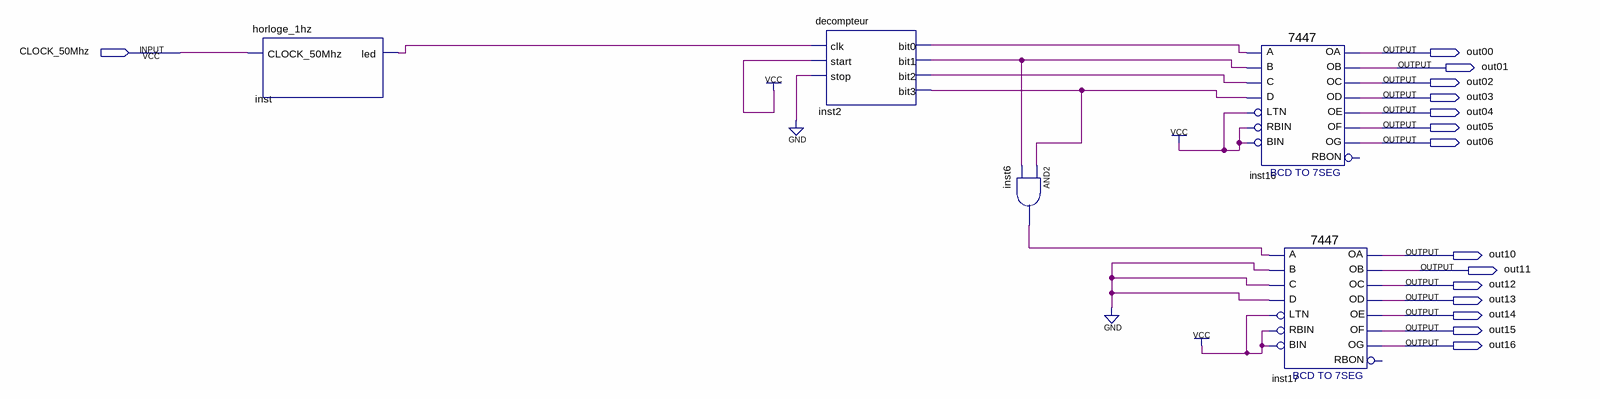
[diagram p0: schematic sheet]
// Quartus schematic compteur_9.bdf as structural Verilog: 5 symbols, 15 pins
module compteur_9 (
  input  CLOCK_50Mhz,
  output out00,
  output out01,
  output out02,
  output out03,
  output out04,
  output out05,
  output out06,
  output out10,
  output out11,
  output out12,
  output out13,
  output out14,
  output out15,
  output out16
);

  wire inst2_bit0, inst2_bit1, inst2_bit2, inst2_bit3, inst6_out, inst_led;

  horloge_1hz inst (.CLOCK_50Mhz(CLOCK_50Mhz), .led(inst_led));
  decompteur inst2 (
    .clk(inst_led), .start(1'b1), .stop(1'b0), .bit0(inst2_bit0), .bit1(inst2_bit1), .bit2(inst2_bit2),
    .bit3(inst2_bit3));
  and inst6 (inst6_out, inst2_bit3, inst2_bit1);
  \7447  inst16 (
    .LTN(1'b1), .B(inst2_bit1), .C(inst2_bit2), .D(inst2_bit3), .RBIN(1'b1), .BIN(1'b1), .A(inst2_bit0),
    .OB(out01), .OC(out02), .OE(out04), .OD(out03), .OF(out05), .OG(out06), .OA(out00));  // open: RBON
  \7447  inst17 (
    .LTN(1'b1), .B(1'b0), .C(1'b0), .D(1'b0), .RBIN(1'b1), .BIN(1'b1), .A(inst6_out), .OB(out11), .OC(out12),
    .OE(out14), .OD(out13), .OF(out15), .OG(out16), .OA(out10));  // open: RBON
endmodule
